# EAGLE design question_4 (EAGLE 8.2.2)
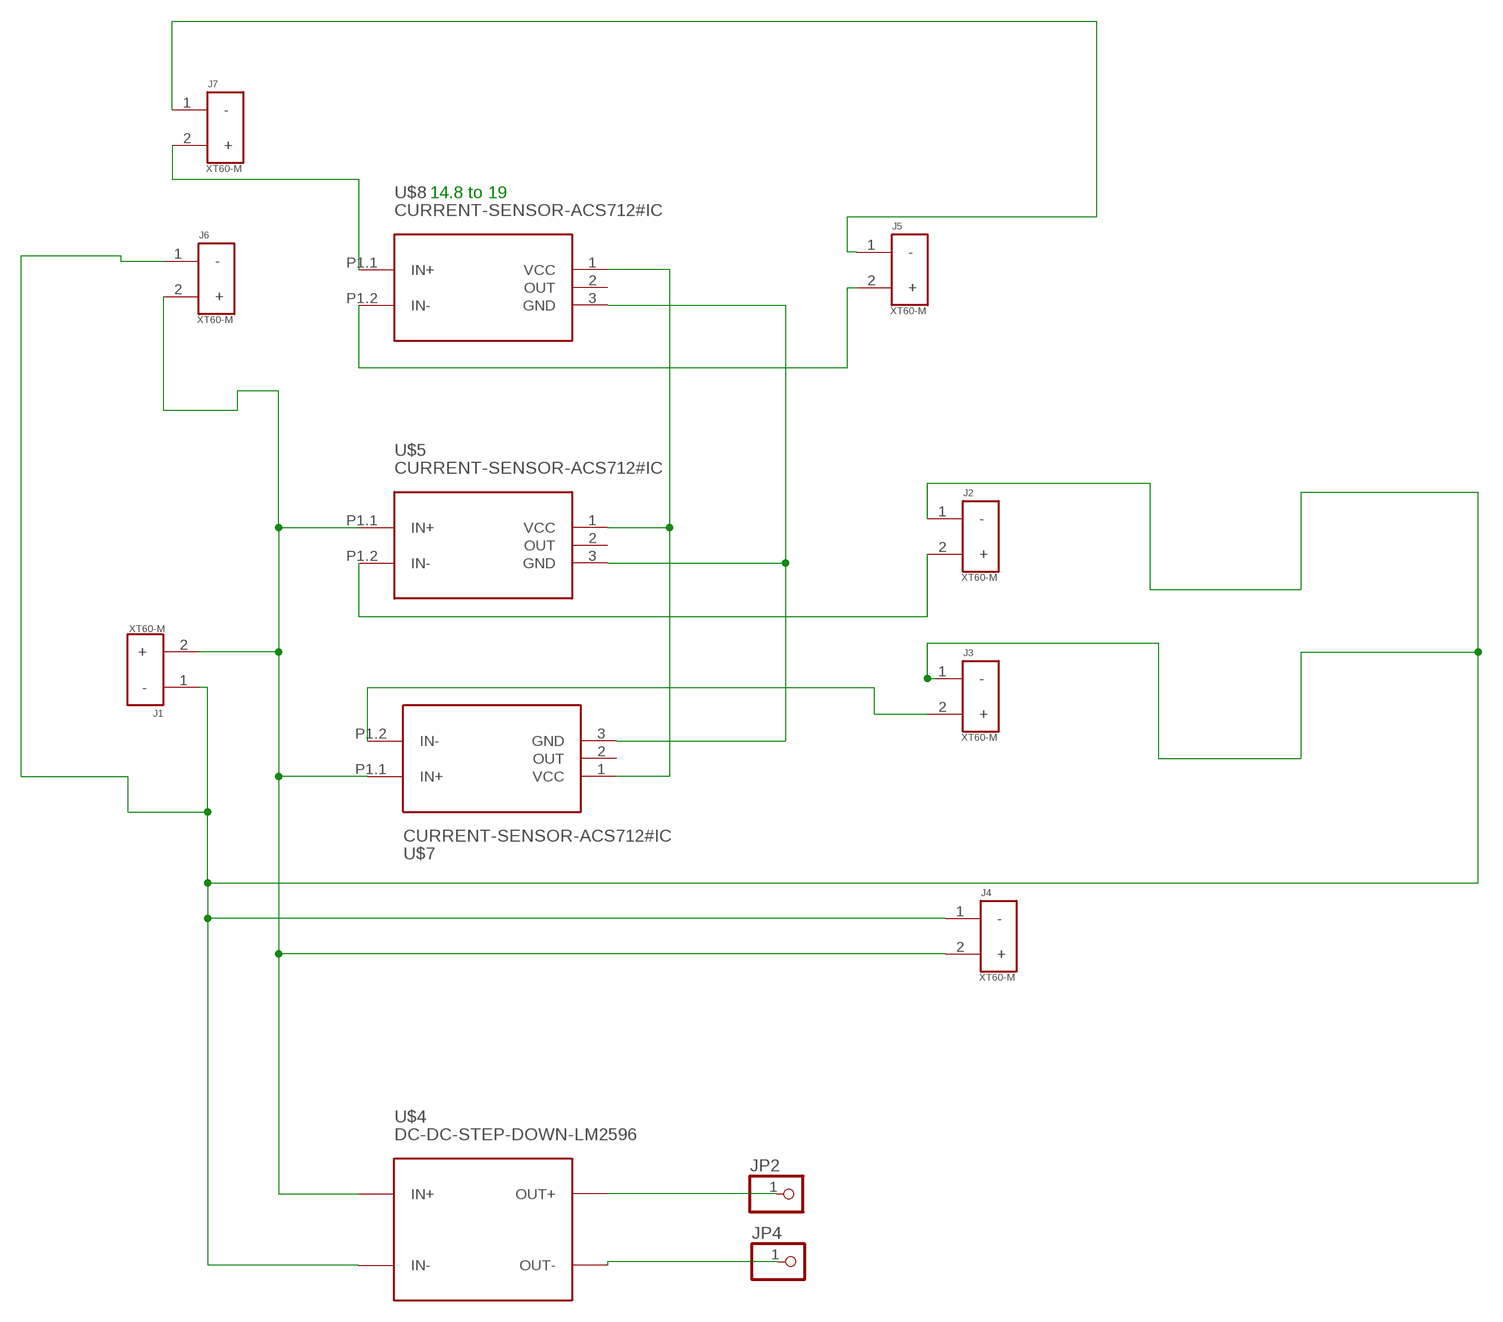
[diagram p0: schematic, sheet 1]

## Parts
J1  XT60-M  [AMASS_XT60-M]
J2  XT60-M  [AMASS_XT60-M]
J3  XT60-M  [AMASS_XT60-M]
J4  XT60-M  [AMASS_XT60-M]
J5  XT60-M  [AMASS_XT60-M]
J6  XT60-M  [AMASS_XT60-M]
J7  XT60-M  [AMASS_XT60-M]
JP2  PINHD-1X1  [1X01]
JP4  PINHD-1X1  [1X01]
U$4  DC-DC-STEP-DOWN-LM2596  [DC-DC-STEP-DOWN-LM2596]
U$5  CURRENT-SENSOR-ACS712#IC  [CURRENT-SENSOR-ACS712#IC]
U$7  CURRENT-SENSOR-ACS712#IC  [CURRENT-SENSOR-ACS712#IC]
U$8  CURRENT-SENSOR-ACS712#IC  [CURRENT-SENSOR-ACS712#IC]

## Nets
N$1: J7.2(+) U$8.P1.1(IN+)
N$2: J1.1(-) J2.1(-) J3.1(-) J4.1(-) J6.1(-) U$4.IN-
N$3: J5.1(-) J7.1(-)
N$4: J1.2(+) J4.2(+) J6.2(+) U$4.IN+ U$5.P1.1(IN+) U$7.P1.1(IN+)
N$5: J2.2(+) U$5.P1.2(IN-)
N$6: JP4.1 U$4.OUT-
N$9: J3.2(+) U$7.P1.2(IN-)
N$11: J5.2(+) U$8.P1.2(IN-)
N$16: JP2.1 U$4.OUT+
N$31: U$5.1(VCC) U$7.1(VCC) U$8.1(VCC)
N$38: U$5.3(GND) U$7.3(GND) U$8.3(GND)
Unconnected: U$5.2(OUT) U$7.2(OUT) U$8.2(OUT)

## Notes on the sheet
- 14.8 to 19

## Library data of the parts
J1-J7 = XT60-M:XT60-M: DC supply; XT60; male; PIN:2; for cable; soldered; 60A; 500V; AVAILABILITY: Unavailable; DESCRIPTION: Plug; DC supply; XT60; male; PIN: 2; for cable; soldered; 30A; 500V; MF: AMASS; MP: XT60-M; PACKAGE: Package Analog Devices; PRICE: None
JP2 JP4 = pinhead:PINHD-1X1: PIN HEADER
U$4 = diy-modules:DC-DC-STEP-DOWN-LM2596: DC/DC Step-Down Regulator based on LM2596-ADJ chip LM2596 datasheet available here: http://www.ti.com/lit/ds/symlink/lm2596.pdf Click here to find device on ebay.com <http://www.ebay.com/sch/lm2596+power+regulator>
U$5 U$7 U$8 = diy-modules:CURRENT-SENSOR-ACS712#IC: Isolated Bipolar Current Sensors based on ACS712 chip Symbol with input pins More details available here: http://embedded-lab.com/blog/a-brief-overview-of-allegro-acs712-current-sensor-part-1/ Click here to find device on ebay.com <http://www.ebay.com/sch/acs712+module> Note: There are many available versions with different pinout. Please check before use

## Board
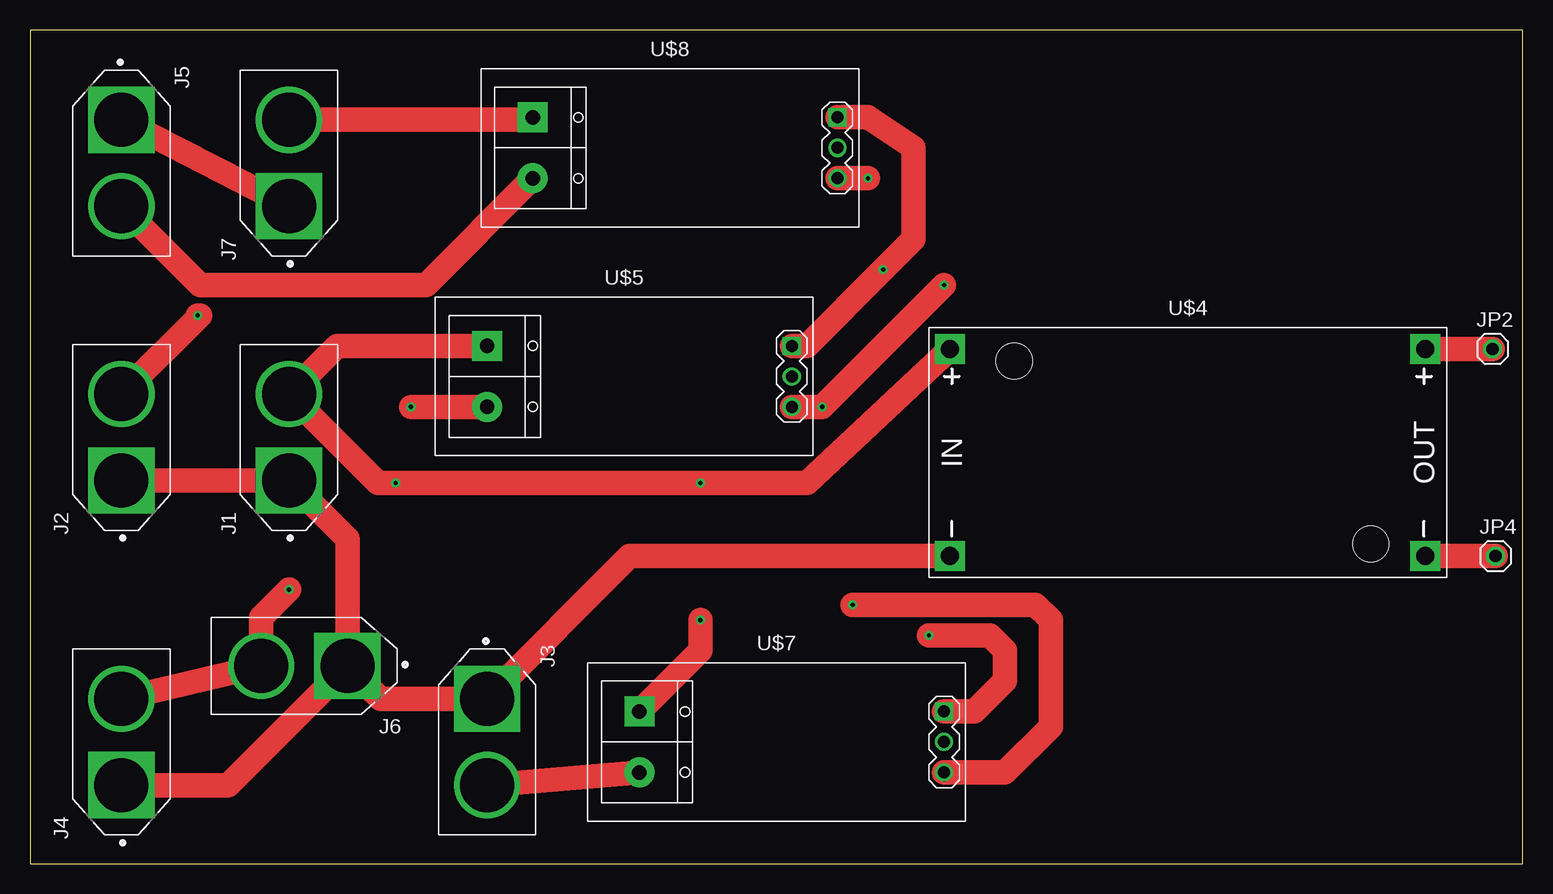
[diagram p1: board, top side]
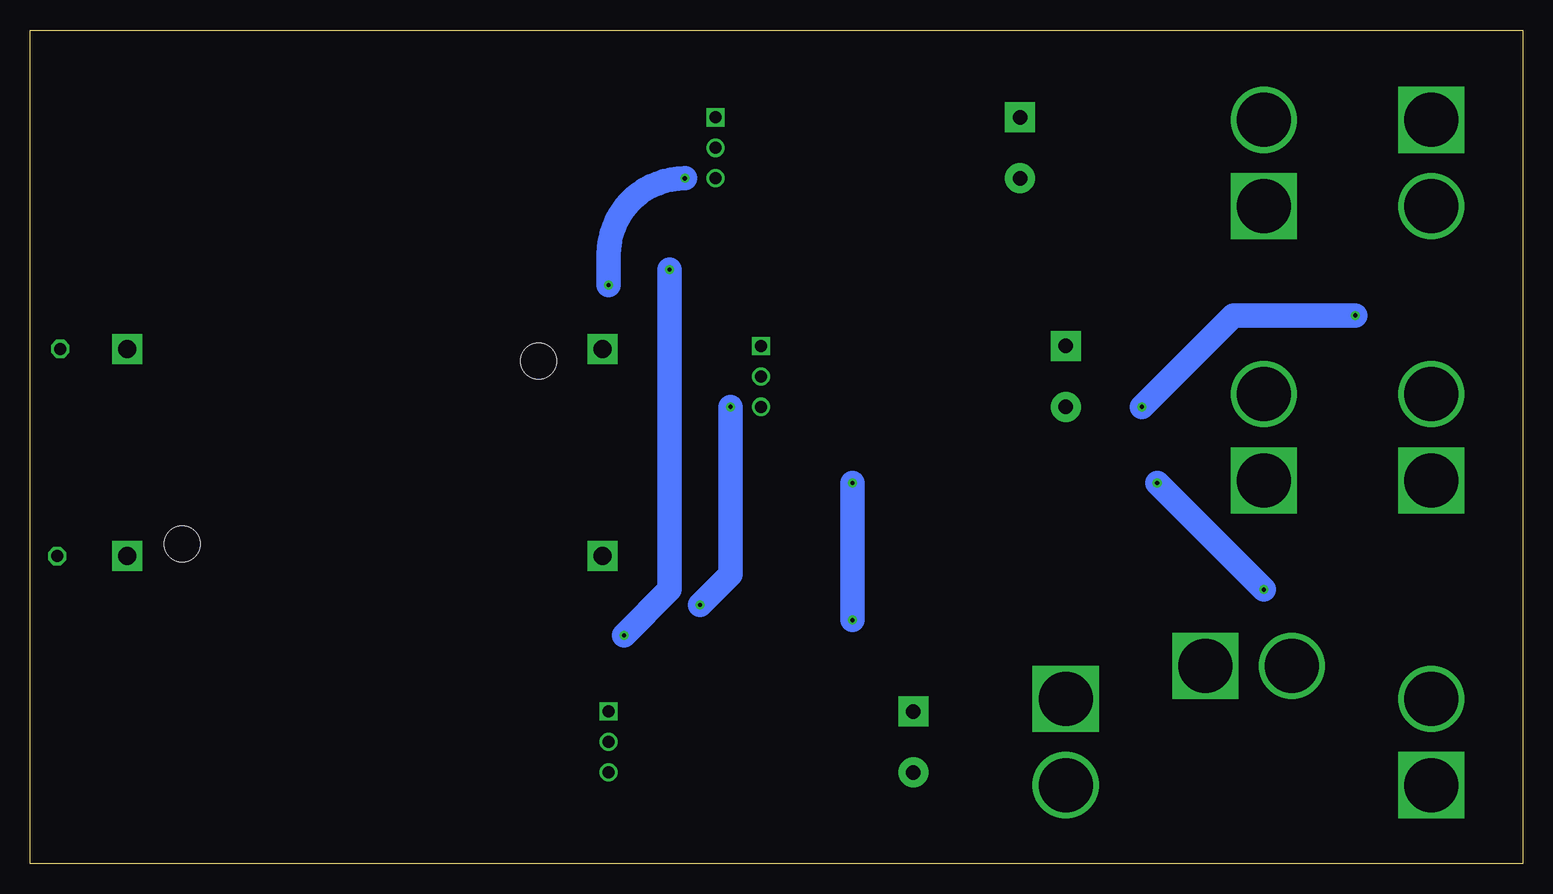
[diagram p2: board, bottom side, seen from below]

Size 124.44 x 69.52 mm. Coordinates in mm from the lower left corner, seen from the top.
Outline: 0,0 124.44,0 124.44,69.52 0,69.52 0,0
Copper layers (1*16): Top 0.035mm / dielectric 1.5mm / Bottom 0.035mm
Design rules "default": minimum track width 6mil, minimum drill 0.35mm, track to track 6mil, track to pad 6mil, pad to pad 6mil, via to via 6mil, smd to smd 6mil, copper to edge 40mil, drill to drill 6mil, minimum pad ring 10mil, minimum via ring 8mil, stop-mask expansion 4mil, vias tented up to drill 0mil, thermal gap 10mil

### Footprints (pad centres in the part's own frame; a part is rotated, then mirrored left to right if it is on the bottom)
AMASS_XT60-M = drill 4.5 square: 1 -3.6,0 | drill 4.5: 2 3.6,0
1X01 = drill 1.016 octagon: 1 0,0
DC-DC-STEP-DOWN-LM2596 = drill 1.5 pad 2.5 square: IN+ -19.812,8.636; IN- -19.812,-8.636; OUT+ 19.812,8.636; OUT- 19.812,-8.636 | hole 3: -14.478,7.62; 15.24,-7.62
CURRENT-SENSOR-ACS712#IC = drill 1 square: 1 13.97,2.54 | drill 1: 2 13.97,0; 3 13.97,-2.54 | drill 1.2 pad 2.5 square: P1.1 -11.43,2.54 | drill 1.2 pad 2.5: P1.2 -11.43,-2.54

### Placement (x,y rotation side)
J1  21.59,35.56 90 top
J2  7.62,35.56 90 top
J3  38.1,10.16 270 top
J4  7.62,10.16 90 top
J5  7.62,58.42 270 top
J6  22.86,16.51 180 top
J7  21.59,58.42 90 top
JP2  121.92,42.93 0 top
JP4  122.17,25.65 0 top
U$4  96.52,34.29 0 top
U$5  49.53,40.64 0 top
U$7  62.23,10.16 0 top
U$8  53.34,59.69 0 top

### Tracks (layer width: path | path; a pad name or v marks a point on that pad's centre or on a via)
N$1
  Top 2.032: J7.2 41.7,62.02 U$8.P1.1
N$2
  Top 2.032: U$4.IN- 49.99,25.65 J3.1 29.21,13.76 J6.1 | J4.1 16.51,6.56 J6.1 | J2.1 J1.1 26.46,27.09 J6.1
N$3
  Top 2.032: J5.1 J7.1
N$4  (via drill 0.35)
  Top 2.032: J4.2 J6.2 19.26,20.53 v21.59,22.86 | U$5.P1.1 25.61,43.18 J1.2 29,31.75 v30.48,31.75 v55.88,31.75 64.77,31.75 U$4.IN+ | U$7.P1.1 55.88,17.78 v55.88,20.32
  Bottom 2.032: v55.88,20.32 v55.88,31.75 | v21.59,22.86 v30.48,31.75
N$5  (via drill 0.35)
  Top 2.032: v31.75,38.1 U$5.P1.2 | J2.2 14.18,45.72 v13.97,45.72
  Bottom 2.032: v13.97,45.72 24.13,45.72 v31.75,38.1
N$6
  Top 2.032: U$4.OUT- JP4.1
N$9
  Top 2.032: J3.2 U$7.P1.2
N$11
  Top 2.032: J5.2 14.18,48.26 33.02,48.26 U$8.P1.2
N$16
  Top 2.032: U$4.OUT+ JP2.1
N$31  (via drill 0.35)
  Top 2.032: U$8.1 69.85,62.23 73.66,59.69 73.66,52.07 v71.12,49.53 64.77,43.18 U$5.1 | U$7.1 78.74,12.7 81.28,15.24 81.28,17.78 80.01,19.05 v74.93,19.05
  Bottom 2.032: v71.12,49.53 71.12,22.86 v74.93,19.05
N$38  (via drill 0.35)
  Top 2.032: U$8.3 v69.85,57.15 | U$5.3 v66.04,38.1 v76.2,48.26 | U$7.3 81.28,7.62 85.09,11.43 85.09,20.32 83.82,21.59 v68.58,21.59
  Bottom 2.032: v69.85,57.15 arc-90 76.2,50.8 v76.2,48.26 | v66.04,38.1 66.04,24.13 v68.58,21.59